# Altium schematic sheet CONNECTOR.schdoc
size 120 x 183 mm
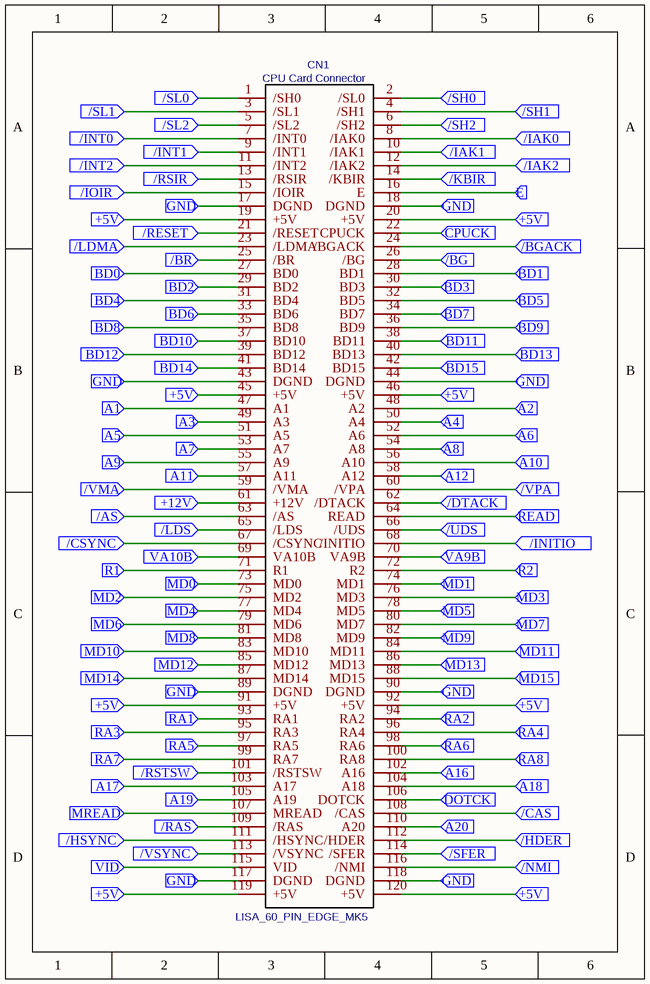
[diagram p0: CONNECTOR.schdoc]

## Parts
CN1  CPU Card Connector  [LISA_60_PIN_EDGE_MK5]

## Ports
+5V (in), +12V (in), /AS (in), /BG (in), /BGACK (in), /BR (in), /CAS (in), /CSYNC (in), /DTACK (in), /HDER (in), /HSYNC (in), /IAK0 (in), /IAK1 (in), /IAK2 (in), /INITIO (in), /INT0 (in), /INT1 (in), /INT2 (in), /IOIR (in), /KBIR (in), /LDMA (in), /LDS (in), /NMI (in), /RAS (in), /RESET (in), /RSIR (in), /RSTSW (in), /SFER (in), /SH0 (in), /SH1 (in), /SH2 (in), /SL0 (in), /SL1 (in), /SL2 (in), /UDS (in), /VMA (in), /VPA (in), /VSYNC (in), A1 (in), A2 (in), A3 (in), A4 (in), A5 (in), A6 (in), A7 (in), A8 (in), A9 (in), A10 (in), A11 (in), A12 (in), A16 (in), A17 (in), A18 (in), A19 (in), A20 (in), BD0 (in), BD1 (in), BD2 (in), BD3 (in), BD4 (in), BD5 (in), BD6 (in), BD7 (in), BD8 (in), BD9 (in), BD10 (in), BD11 (in), BD12 (in), BD13 (in), BD14 (in), BD15 (in), CPUCK (in), DOTCK (in), E (in), GND (in), MD0 (in), MD1 (in), MD2 (in), MD3 (in), MD4 (in), MD5 (in), MD6 (in), MD7 (in), MD8 (in), MD9 (in), MD10 (in), MD11 (in), MD12 (in), MD13 (in), MD14 (in), MD15 (in), MREAD (in), R1 (in), R2 (in), RA1 (in), RA2 (in), RA3 (in), RA4 (in), RA5 (in), RA6 (in), RA7 (in), RA8 (in), READ (in), VA9B (in), VA10B (in), VID (in)

## Nets
+5V: CN1.19(+5V) CN1.20(+5V) CN1.45(+5V) CN1.46(+5V) CN1.91(+5V) CN1.92(+5V) CN1.119(+5V) CN1.120(+5V) ; port +5V
+12V: CN1.61(+12V) ; port +12V
/AS: CN1.63(/AS) ; port /AS
/BG: CN1.26(/BG) ; port /BG
/BGACK: CN1.24(/BGACK) ; port /BGACK
/BR: CN1.25(/BR) ; port /BR
/CAS: CN1.108(/CAS) ; port /CAS
/CSYNC: CN1.67(/CSYNC) ; port /CSYNC
/DTACK: CN1.62(/DTACK) ; port /DTACK
/HDER: CN1.112(/HDER) ; port /HDER
/HSYNC: CN1.111(/HSYNC) ; port /HSYNC
/IAK0: CN1.8(/IAK0) ; port /IAK0
/IAK1: CN1.10(/IAK1) ; port /IAK1
/IAK2: CN1.12(/IAK2) ; port /IAK2
/INITIO: CN1.68(/INITIO) ; port /INITIO
/INT0: CN1.7(/INT0) ; port /INT0
/INT1: CN1.9(/INT1) ; port /INT1
/INT2: CN1.11(/INT2) ; port /INT2
/IOIR: CN1.15(/IOIR) ; port /IOIR
/KBIR: CN1.14(/KBIR) ; port /KBIR
/LDMA: CN1.23(/LDMA) ; port /LDMA
/LDS: CN1.65(/LDS) ; port /LDS
/NMI: CN1.116(/NMI) ; port /NMI
/RAS: CN1.109(/RAS) ; port /RAS
/RESET: CN1.21(/RESET) ; port /RESET
/RSIR: CN1.13(/RSIR) ; port /RSIR
/RSTSW: CN1.101(/RSTSW) ; port /RSTSW
/SFER: CN1.114(/SFER) ; port /SFER
/SH0: CN1.2(/SL0) ; port /SH0
/SH1: CN1.4(/SH1) ; port /SH1
/SH2: CN1.6(/SH2) ; port /SH2
/SL0: CN1.1(/SH0) ; port /SL0
/SL1: CN1.3(/SL1) ; port /SL1
/SL2: CN1.5(/SL2) ; port /SL2
/UDS: CN1.66(/UDS) ; port /UDS
/VMA: CN1.59(/VMA) ; port /VMA
/VPA: CN1.60(/VPA) ; port /VPA
/VSYNC: CN1.113(/VSYNC) ; port /VSYNC
A1: CN1.47(A1) ; port A1
A2: CN1.48(A2) ; port A2
A3: CN1.49(A3) ; port A3
A4: CN1.50(A4) ; port A4
A5: CN1.51(A5) ; port A5
A6: CN1.52(A6) ; port A6
A7: CN1.53(A7) ; port A7
A8: CN1.54(A8) ; port A8
A9: CN1.55(A9) ; port A9
A10: CN1.56(A10) ; port A10
A11: CN1.57(A11) ; port A11
A12: CN1.58(A12) ; port A12
A16: CN1.102(A16) ; port A16
A17: CN1.103(A17) ; port A17
A18: CN1.104(A18) ; port A18
A19: CN1.105(A19) ; port A19
A20: CN1.110(A20) ; port A20
BD0: CN1.27(BD0) ; port BD0
BD1: CN1.28(BD1) ; port BD1
BD2: CN1.29(BD2) ; port BD2
BD3: CN1.30(BD3) ; port BD3
BD4: CN1.31(BD4) ; port BD4
BD5: CN1.32(BD5) ; port BD5
BD6: CN1.33(BD6) ; port BD6
BD7: CN1.34(BD7) ; port BD7
BD8: CN1.35(BD8) ; port BD8
BD9: CN1.36(BD9) ; port BD9
BD10: CN1.37(BD10) ; port BD10
BD11: CN1.38(BD11) ; port BD11
BD12: CN1.39(BD12) ; port BD12
BD13: CN1.40(BD13) ; port BD13
BD14: CN1.41(BD14) ; port BD14
BD15: CN1.42(BD15) ; port BD15
CPUCK: CN1.22(CPUCK) ; port CPUCK
DOTCK: CN1.106(DOTCK) ; port DOTCK
E: CN1.16(E) ; port E
GND: CN1.17(DGND) CN1.18(DGND) CN1.43(DGND) CN1.44(DGND) CN1.89(DGND) CN1.90(DGND) CN1.117(DGND) CN1.118(DGND) ; port GND
MD0: CN1.73(MD0) ; port MD0
MD1: CN1.74(MD1) ; port MD1
MD2: CN1.75(MD2) ; port MD2
MD3: CN1.76(MD3) ; port MD3
MD4: CN1.77(MD4) ; port MD4
MD5: CN1.78(MD5) ; port MD5
MD6: CN1.79(MD6) ; port MD6
MD7: CN1.80(MD7) ; port MD7
MD8: CN1.81(MD8) ; port MD8
MD9: CN1.82(MD9) ; port MD9
MD10: CN1.83(MD10) ; port MD10
MD11: CN1.84(MD11) ; port MD11
MD12: CN1.85(MD12) ; port MD12
MD13: CN1.86(MD13) ; port MD13
MD14: CN1.87(MD14) ; port MD14
MD15: CN1.88(MD15) ; port MD15
MREAD: CN1.107(MREAD) ; port MREAD
R1: CN1.71(R1) ; port R1
R2: CN1.72(R2) ; port R2
RA1: CN1.93(RA1) ; port RA1
RA2: CN1.94(RA2) ; port RA2
RA3: CN1.95(RA3) ; port RA3
RA4: CN1.96(RA4) ; port RA4
RA5: CN1.97(RA5) ; port RA5
RA6: CN1.98(RA6) ; port RA6
RA7: CN1.99(RA7) ; port RA7
RA8: CN1.100(RA8) ; port RA8
READ: CN1.64(READ) ; port READ
VA9B: CN1.70(VA9B) ; port VA9B
VA10B: CN1.69(VA10B) ; port VA10B
VID: CN1.115(VID) ; port VID

## Notes on the sheet
- (in symbol CPU Card Connector) LISA_60_PIN_EDGE_MK5

## Library data of the parts
CN1 = CPU Card Connector: Contributor: will_tooker; Package Display: Yes; spicePre: U; spiceSymbolName: Lisa CPU Connector